# Altium schematic sheet SENSOR.SchDoc
size A4; SheetNumber: 2; SheetTotal: 4
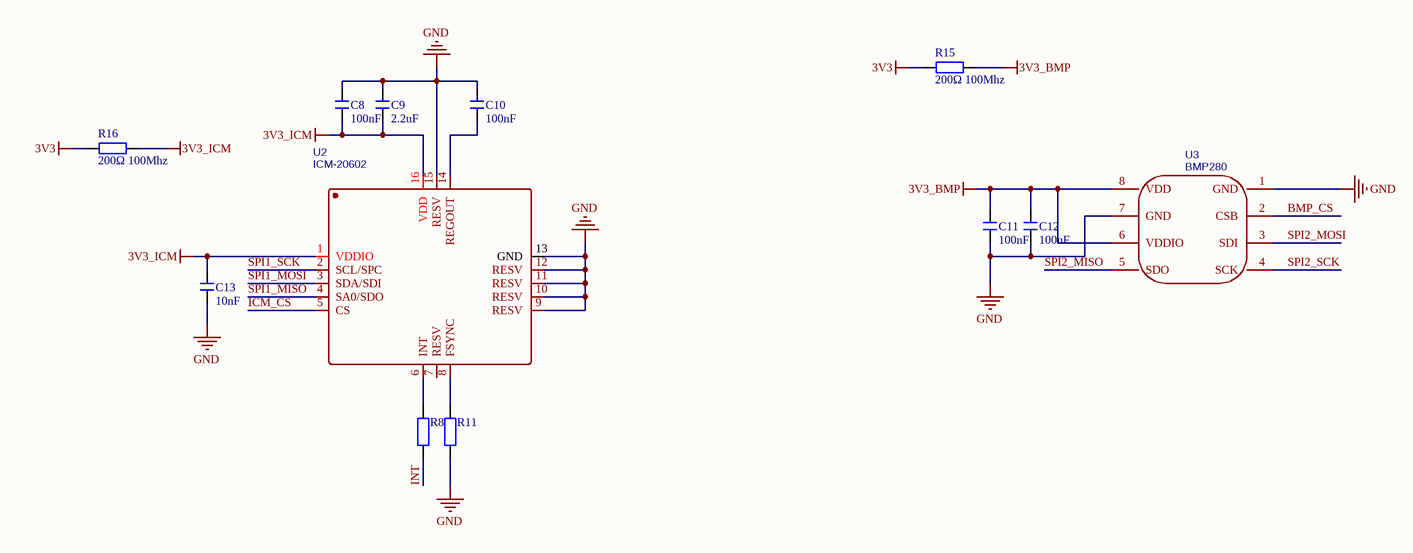
[diagram p0: SENSOR.SchDoc]

## Parts
C8  100nF  [C 0603_L]
C9  2.2uF  [C 0603_L]
C10  100nF  [C 0603_L]
C11  100nF  [C 0603_L]
C12  100nF  [C 0603_L]
C13  10nF  [C 0603_L]
R8  (no value)  [R 0603_L]
R11  (no value)  [R 0603_L]
R15  200Ω 100Mhz  [R 0805_L]
R16  200Ω 100Mhz  [R 0805_L]
U2  ICM-20602  [LGA-16_L3.0-W3.0-P0.50-BL]
U3  BMP280  [LGA-8_L2.5-W2.0-P0.65_AMP6127]

## Nets
3V3: R15.1 R16.1
3V3_BMP: C11.1 C12.1 R15.2 U3.6(VDDIO) U3.8(VDD)
3V3_ICM: C8.2 C9.2 C13.2 R16.2 U2.1(VDDIO) U2.16(VDD)
GND: C8.1 C9.1 C10.1 C11.2 C12.2 C13.1 R11.2 U2.9(RESV) U2.10(RESV) U2.11(RESV) U2.12(RESV) U2.13(GND) U2.15(RESV) U3.1(GND) U3.7(GND)
BMP_CS: U3.2(CSB)
ICM_CS: U2.5(CS)
INT: R8.2
SPI1_MISO: U2.4(SA0/SDO)
SPI1_MOSI: U2.3(SDA/SDI)
SPI1_SCK: U2.2(SCL/SPC)
SPI2_MISO: U3.5(SDO)
SPI2_MOSI: U3.3(SDI)
SPI2_SCK: U3.4(SCK)
NetC10_2: C10.2 U2.14(REGOUT)
NetR8_1: R8.1 U2.6(INT)
NetR11_1: R11.1 U2.8(FSYNC)

Not connected (* = marked no-connect by the designer): U2 7(RESV)

## Library data of the parts
C8-C13 = C: 无极性贴片电容; 版权归属: 源创客; BOM名称: 无极性贴片电容; 学习资源: www.ooocke.com
R8 R11 = R: 贴片电阻; 版权归属: 源创客; BOM名称: 贴片电阻; 学习资源: www.ooocke.com
R15 R16 = R: 磁珠; BOM名称: 贴片电阻; 版权归属: 源创客; 学习资源: www.ooocke.com
U2 = ICM-20602: 六轴MEMS运动跟踪设备; Manufacturer: TDK InvenSense(应美盛); Contributor: LCSC; Supplier: LCSC; Supplier Part: C97633; Manufacturer Part: ICM-20602; JLCPCB Part Class: Extended Part; link: https://so.szlcsc.com/global.html?k=C97633&ref=editor; spicePre: U; spiceSymbolName: ICM-20602
U3 = BMP280: Manufacturer: Bosch(博世); Supplier: LCSC; Manufacturer Part: BMP280; Supplier Part: C83291; JLCPCB Part Class: Extended Part; spicePre: U; spiceSymbolName: BMP280